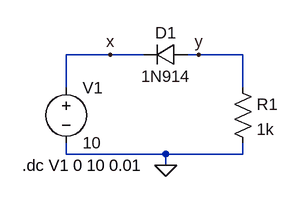
[diagram p0: schematic silicon rev_S20210020323.asc]
silicon rev_S20210020323.asc, the LTspice schematic file:
Version 4
SHEET 1 880 680
WIRE 64 80 0 80
WIRE 112 80 64 80
WIRE 192 80 176 80
WIRE 256 80 192 80
WIRE 0 128 0 80
WIRE 256 128 256 80
WIRE 0 224 0 208
WIRE 144 224 0 224
WIRE 256 224 256 208
WIRE 256 224 144 224
WIRE 144 240 144 224
FLAG 144 240 0
FLAG 64 80 x
FLAG 192 80 y
SYMBOL voltage 0 112 R0
SYMATTR InstName V1
SYMATTR Value 10
SYMBOL diode 176 64 R90
WINDOW 0 0 32 VBottom 2
WINDOW 3 32 32 VTop 2
SYMATTR InstName D1
SYMATTR Value 1N914
SYMBOL res 240 112 R0
SYMATTR InstName R1
SYMATTR Value 1k
TEXT -64 240 Left 2 !.dc V1 0 10 0.01

The netlist it stands for:
* silicon rev_S20210020323.asc
V1 x 0 10
D1 y x 1N914
R1 y 0 1k
.model D D
.lib standard.dio
.dc V1 0 10 0.01
.backanno
.end